# EAGLE design full_motor_1 (EAGLE 7.5.0)
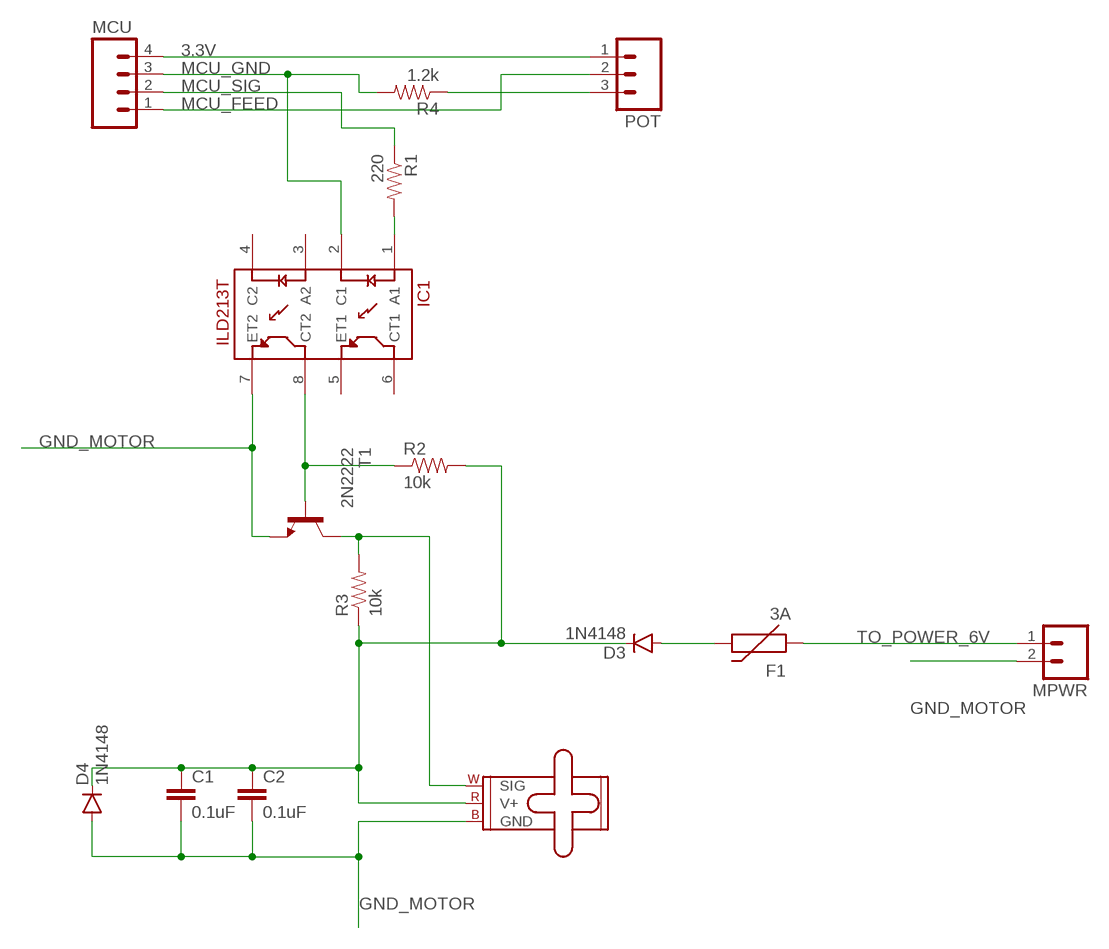
[diagram p0: schematic, sheet 1]

## Parts
C1  0.1uF  CAP1206  [1206]
C2  0.1uF  CAP1206  [1206]
D3  1N4148  DIODE1N4148  [DIODE-1N4148]
D4  1N4148  DIODE1N4148  [DIODE-1N4148]
F1  3A  PTCSMD  [PTC-1206]
IC1  ILD213T  [SO08]
MCU  M04PTH  [1X04]
MPWR  M02PTH  [1X02]
POT  M03PTH  [1X03]
R1  220  RESISTOR1206  [1206]
R2  10k  RESISTOR1206  [1206]
R3  10k  RESISTOR1206  [1206]
R4  1.2k  RESISTOR1206  [1206]
SERVO  SMALL_SERVO  [1X03]
T1  2N2222  [TO92-EBC-OVAL]

## Nets
3.3V: MCU.4 POT.1
6V_POWER: C1.1 C2.1 D3.C D4.C R2.2 R3.1 SERVO.2(V+)
GND_MOTOR: C1.2 C2.2 D4.A IC1.7(ET2) MPWR.2 SERVO.3(GND) T1.E
MCU_FEED: MCU.1 POT.2
MCU_GND: IC1.2(C1) MCU.3 R4.2
MCU_SIG: MCU.2 R1.1
N$1: IC1.1(A1) R1.2
N$2: POT.3 R4.1
N$3: IC1.8(CT2) R2.1 T1.B
N$4: D3.A F1.2
N$6: R3.2 SERVO.1(SIG) T1.C
TO_POWER_6V: F1.1 MPWR.1
Unconnected: IC1.3(A2) IC1.4(C2) IC1.5(ET1) IC1.6(CT1)

## Library data of the parts
C1 C2 = SparkFun-Passives:CAP: Capacitor Standard 0603 ceramic capacitor, and 0.1" leaded capacitor.
D3 D4 = SparkFun-DiscreteSemi:DIODE: Diode These are standard reverse protection diodes and small signal diodes. SMA package can handle up to about 1A. SOD-323 can handle about 200mA. What the SOD-323 package when ordering, there are some mfgs out there that are 5-pin packages.; PROD_ID: DIO-08378
F1 = SparkFun-PowerIC:PTC: Resettable Fuse PTC Resettable Fuse. Spark Fun Electronics SKU : COM-08357; PROD_ID: RES-11150
IC1 = SparkFun-DiscreteSemi:ILD213T: Dual optoisolator.
MCU = SparkFun-Connectors:M04: Header 4 Standard 4-pin 0.1" header. Use with straight break away headers (SKU : PRT-00116), right angle break away headers (PRT-00553), swiss pins (PRT-00743), machine pins (PRT-00117), and female headers (PRT-00115). Molex polarized connector foot print use with SKU : PRT-08231 with associated crimp pins and housings. 1MM SMD Version SKU: PRT-10208; PROD_ID: CONN-09696
MPWR = SparkFun-Connectors:M02: Standard 2-pin 0.1" header. Use with - straight break away headers ( PRT-00116) - right angle break away headers (PRT-00553) - swiss pins (PRT-00743) - machine pins (PRT-00117) - female headers (PRT-00115) Molex polarized connector foot print use with: PRT-08233 with associated crimp pins and housings. 2.54_SCREWTERM for use with PRT-10571. 3.5mm Screw Terminal footprints for PRT-08084 5mm Screw Terminal footprints for use with PRT-08432
POT = SparkFun-Connectors:M03: Header 3 Standard 3-pin 0.1" header. Use with straight break away headers (SKU : PRT-00116), right angle break away headers (PRT-00553), swiss pins (PRT-00743), machine pins (PRT-00117), and female headers (PRT-00115). Molex polarized connector foot print use with SKU : PRT-08232 with associated crimp pins and housings.
R1-R4 = SparkFun-Passives:RESISTOR: Resistor Basic schematic elements and footprints for 0603, 1206, and PTH resistors.
SERVO = SparkFun-Electromechanical:SMALL_SERVO: Small servo motor This is the small servo used in the SIK. SKU: ROB-09065
T1 = adafruit:2N2222: NPN TRANSISTOR Big oval pads

## Board
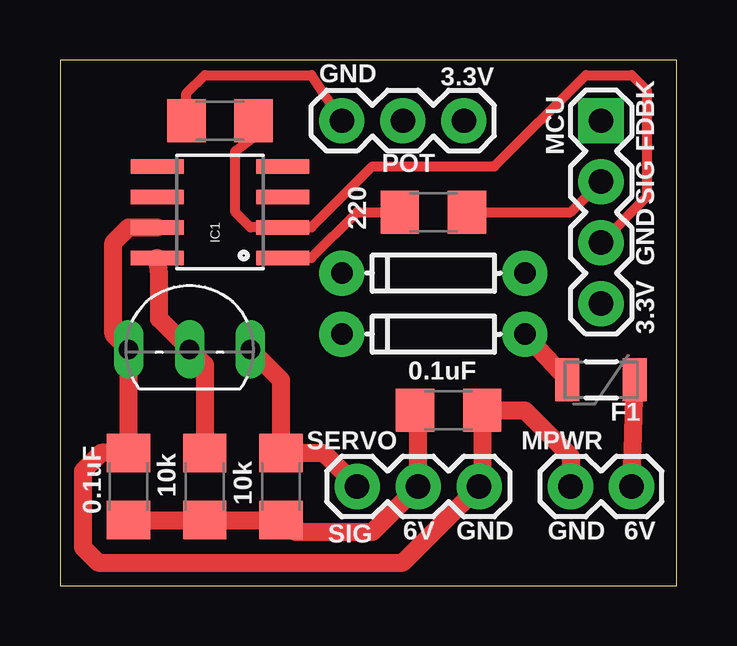
[diagram p1: board, top side]
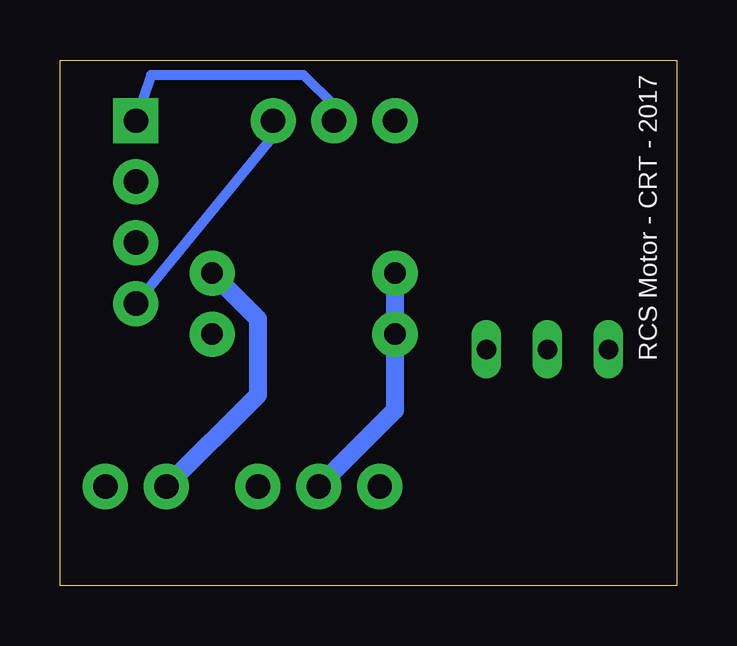
[diagram p2: board, bottom side, seen from below]

Size 25.7 x 21.9 mm. Coordinates in mm from the lower left corner, seen from the top.
Outline: 0,0 25.7,0 25.7,21.9 0,21.9 0,0
Copper layers (1*16): Top 0.0356mm / dielectric 1.5011mm / Bottom 0.0356mm
Design rules "LaenPCBOrder": minimum track width 6mil, minimum drill 13mil, track to track 6mil, track to pad 6mil, pad to pad 6mil, via to via 6mil, smd to smd 6mil, copper to edge 15mil, drill to drill 6mil, minimum pad ring 7mil, minimum via ring 7mil, stop-mask expansion 3mil, vias tented up to drill 0mil, thermal gap 10mil

### Footprints (pad centres in the part's own frame; a part is rotated, then mirrored left to right if it is on the bottom)
1206 = smd 1.6 x 1.8: 1 -1.4,0; 2 1.4,0
DIODE-1N4148 = drill 0.9 pad 1.88: A -3.81,0; C 3.81,0
PTC-1206 = smd 1 x 1.8: 1 -1.4,0; 2 1.4,0
SO08 = smd 0.61 x 2.21: 1 -1.905,-2.616; 2 -0.635,-2.616; 3 0.635,-2.616; 4 1.905,-2.616; 5 1.905,2.616; 6 0.635,2.616; 7 -0.635,2.616; 8 -1.905,2.616
1X04 = drill 1.016 pad 1.88 square: 1 0,0 | drill 1.016 pad 1.88: 2 2.54,0; 3 5.08,0; 4 7.62,0
1X02 = drill 1.016 pad 1.88: 1 0,0; 2 2.54,0
1X03 = drill 1.016 pad 1.88: 1 0,0; 2 2.54,0; 3 5.08,0
TO92-EBC-OVAL = drill 0.813 long: B 0,-1.27; C 2.54,-1.27; E -2.54,-1.27

### Placement (x,y rotation side)
C1  2.86,4.13 90 top
C2  16.19,7.3 0 top
D3  15.56,10.48 180 top
D4  15.56,13.02 180 top
F1  22.54,8.57 180 top
IC1  6.67,15.56 90 top
MCU  22.54,19.37 270 top
MPWR  23.81,4.13 180 top
POT  16.83,19.37 180 top
R1  15.56,15.56 180 top
R2  6.03,4.13 270 top
R3  9.21,4.13 90 top
R4  6.67,19.37 0 top
SERVO  12.38,4.13 0 top
T1  5.4,11.11 0 top

### Tracks (layer width: path | path; a pad name or v marks a point on that pad's centre or on a via)
3.3V
  Bottom 0.406: POT.1 16.83,18.73 MCU.4
6V_POWER
  Top 0.406: 14.92,7.17 C2.1
  Top 0.759: C1.1 R2.2 R3.1 9.84,2.22 13.02,2.22 SERVO.2 14.92,7.17
  Bottom 0.759: D4.C D3.C 11.75,7.3 SERVO.2
GND_MOTOR
  Top 0.406: 17.59,4.26 SERVO.3
  Top 0.759: SERVO.3 14.29,0.95 1.59,0.95 0.95,1.59 0.95,4.76 1.72,5.53 C1.2 T1.E 2.22,10.48 2.22,14.29 2.86,14.92 IC1.7 | 17.59,4.26 C2.2 19.37,7.3 21.27,5.4 MPWR.2
  Bottom 0.759: D4.A 17.46,11.11 17.46,7.94 MPWR.2
MCU_FEED
  Bottom 0.406: POT.2 14.29,20 15.56,21.27 21.91,21.27 MCU.1
MCU_GND
  Top 0.406: R4.2 8.07,18.68 7.3,18.1 7.3,15.56 7.94,14.92 IC1.2 10.48,14.92 13.02,17.46 18.1,17.46 21.91,21.27 23.81,21.27 24.45,20.64 24.45,16.19 MCU.3
MCU_SIG
  Top 0.406: R1.1 21.27,15.56 MCU.2
N$1
  Top 0.406: IC1.1 10.48,13.65 12.38,15.56 R1.2
N$2
  Top 0.406: R4.1 5.27,20.51 6.03,21.27 10.48,21.27 POT.3
N$3
  Top 0.759: R2.1 6.03,9.21 T1.B 4.13,11.11 4.13,13.02 IC1.8
N$4
  Top 0.759: D3.A F1.2
N$6
  Top 0.759: T1.C 9.21,8.57 R3.2 10.98,5.53 SERVO.1
TO_POWER_6V
  Top 0.759: MPWR.1 F1.1

### Text on the board
tNames: 3.3V | GND | FDBK | SIG | GND | 3.3V | SIG | 6V | GND | GND | 6V
bNames: RCS Motor - CRT - 2017